# EAGLE schematic font (EAGLE 5.06)
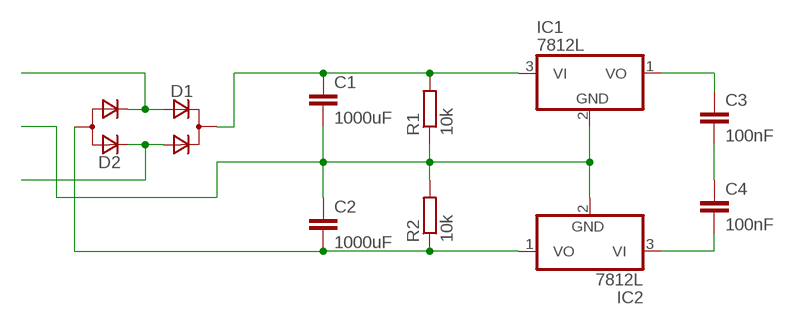
[diagram p0: schematic, sheet 1]

## Parts
C1  1000uF  C-EU025-060X050  [C025-060X050]
C2  1000uF  C-EU025-060X050  [C025-060X050]
C3  100nF  C5/2.5  [C5B2.5]
C4  100nF  C5/2.5  [C5B2.5]
D1  D_2ASOT23  [SOT-23]
D2  D_2CSOT23  [SOT-23]
IC1  7812L  [TO92]
IC2  7812L  [TO92]
R1  10k  R-EU_0207/10  [0207/10]
R2  10k  R-EU_0207/10  [0207/10]

## Nets
N$1: C1.1 D1.1(C) IC1.3(VI) R1.2
N$2: C2.2 D2.1(A) IC2.1(VO) R2.1
N$3: C3.2 C4.1
N$4: C1.2 C2.1 IC1.2(GND) IC2.2(GND) R1.1 R2.2
N$5: D1.2(A1) D2.3(C2)
N$6: D1.3(A2) D2.2(C1)
N$7: C3.1 IC1.1(VO)
N$8: C4.2 IC2.3(VI)

## Library data of the parts
C1 C2 = rcl:C-EU: CAPACITOR, European symbol
C3 C4 = capacitor-wima:C: CAPACITOR naming: grid - package width
D1 = zetex:D_2A: Dual DIODE
D2 = zetex:D_2C: Dual DIODE
IC1 IC2 = linear:78*: Positive VOLTAGE REGULATOR Source: http://cache.national.com/ds/LM/LM78L05.pdf http://www.fairchildsemi.com/ds/LM/LM7805.pdf
R1 R2 = resistor:R-EU_: RESISTOR, European symbol